# EasyEDA Pro project 轮腿PCB.eprj, board PCB1
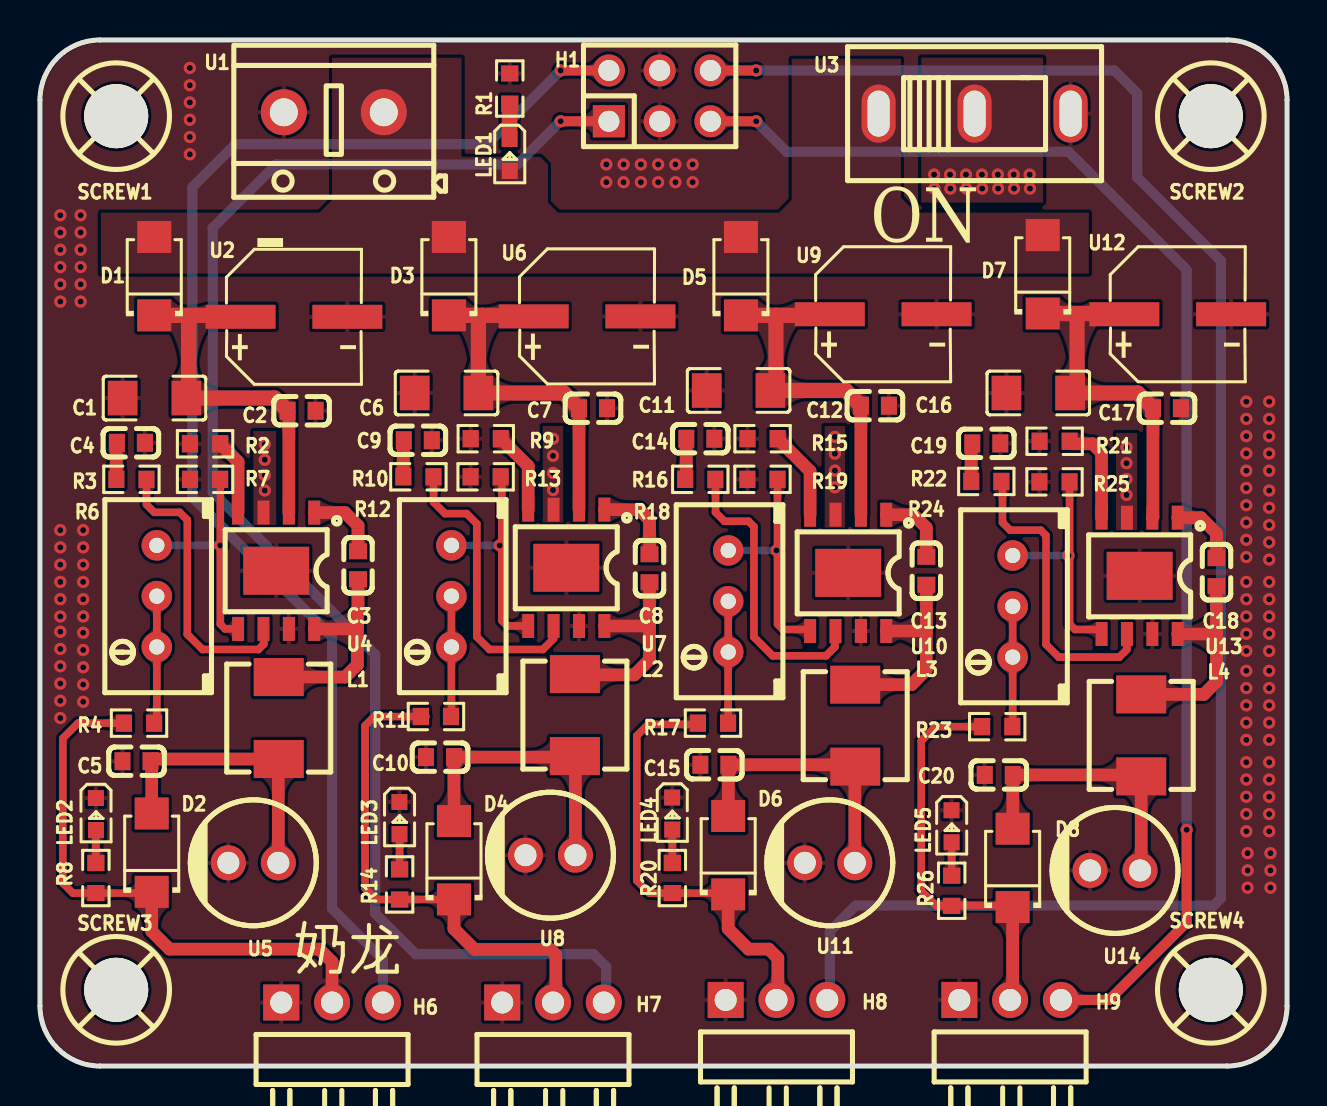
[diagram p6: board, top side]
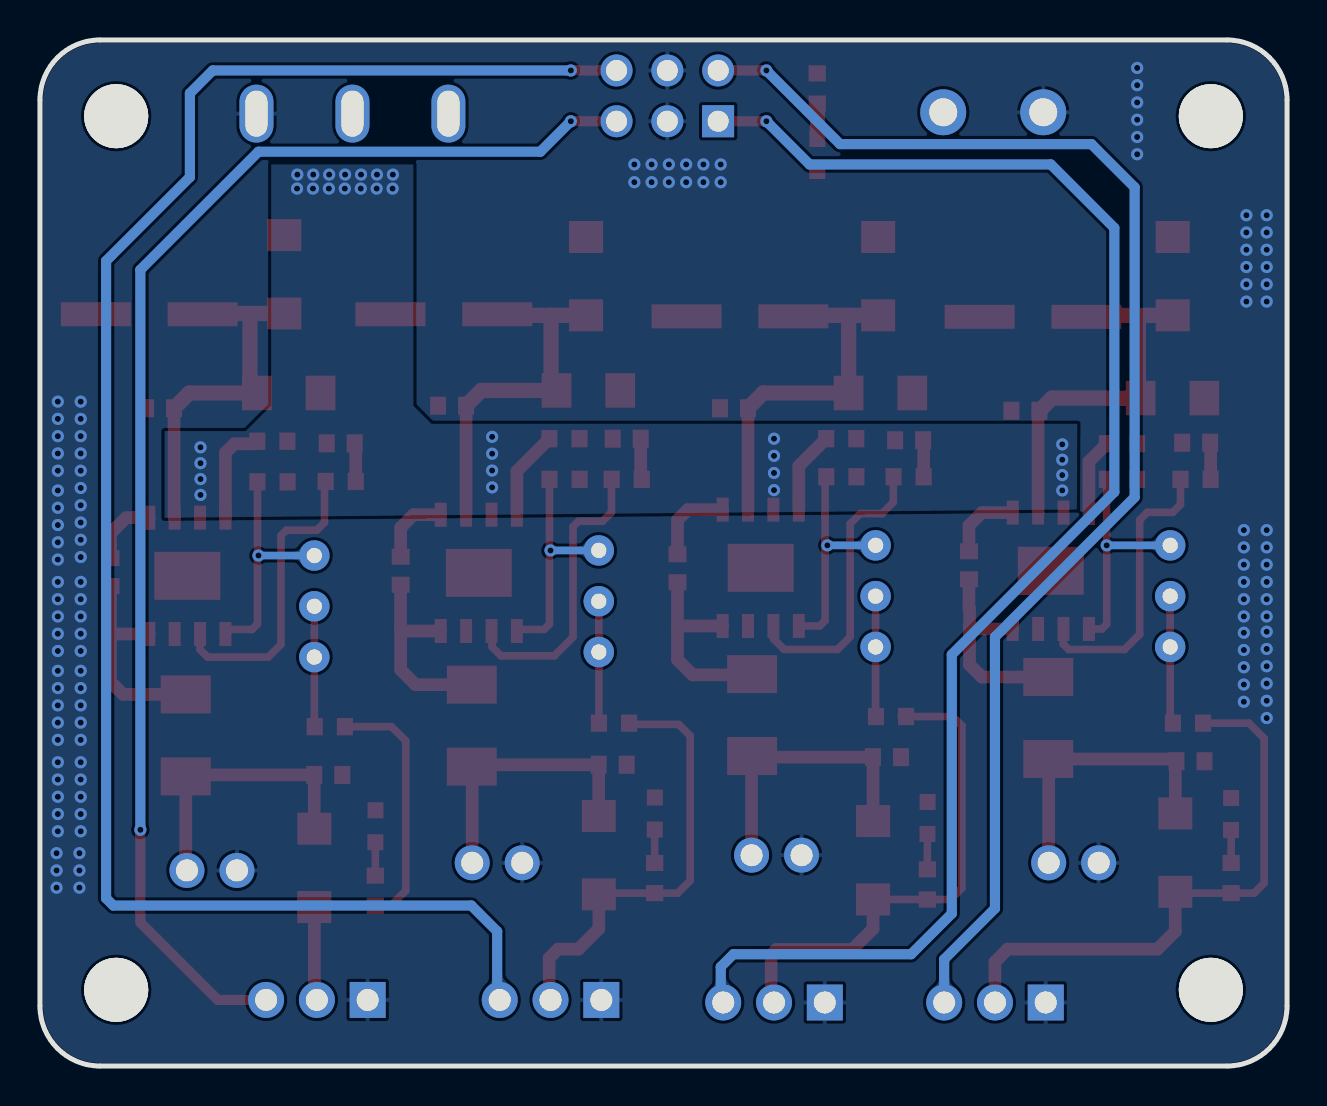
[diagram p7: board, bottom side, seen from below]

Outline 62.36 x 51.31 mm; copper layers: Top Layer, Bottom Layer. Coordinates in mm from the lower left corner of the outline.
Outline path: 0,48.31 0,3 arc(0.88,0.88) 3,0 59.36,0 arc(61.48,0.88) 62.36,3 62.36,48.31 arc(61.48,50.43) 59.36,51.31 3,51.31 arc(0.88,50.43) 0,48.31
Stack: Top Layer 0.035mm / Dielectric1 1.51mm FR4 er 4.5 / Bottom Layer 0.035mm

## Design rules (mm)
template: JLCPCB Capability(Two Layers Board)
spacing copperThickness1oz (default): track to track 0.102, other pairs 0.152 to 0.3
spacing copperThickness2oz: track to track 0.203, other pairs 0.152 to 0.3
track width copperThickness1oz (default): min 0.127, default 0.254, max 2.54
track width copperThickness2oz: min 0.203, default 0.254, max 2.54
differential pair differentialPair (default): width min 0.127, default 0.254, max 2.54; gap min 0.152, default 0.152
via viaSize (default): diameter min 0.5, default 0.61, max 10; hole min 0.3, default 0.305, max 6.3

## Placement (name value [footprint] x y rotation side)
C1  4.7uF  [C1206]  5.73 33.4 0 top
C2  100nF  [C0603]  13.08 32.77 0 top
C3  100nF  [C0603]  15.9 25.04 270 top
C4  4.7nF  [C0603]  4.54 31.17 0 top
C5  47uF  [C0603]  4.83 15.24 0 top
C6  4.7uF  [C1206]  20.33 33.66 0 top
C7  100nF  [C0603]  27.65 32.89 0 top
C8  100nF  [C0603]  30.48 24.89 270 top
C9  4.7nF  [C0603]  18.9 31.29 0 top
C10  47uF  [C0603]  20.01 15.45 0 top
C11  4.7uF  [C1206]  34.94 33.78 0 top
C12  100nF  [C0603]  41.75 33.02 0 top
C13  100nF  [C0603]  44.32 24.77 270 top
C14  4.7nF  [C0603]  33.02 31.37 0 top
C15  47uF  [C0603]  33.72 15.06 0 top
C16  4.7uF  [C1206]  49.92 33.66 0 top
C17  100nF  [C0603]  56.36 32.89 0 top
C18  100nF  [C0603]  58.83 24.7 270 top
C19  4.7nF  [C0603]  47.32 31.14 0 top
C20  47uF  [C0603]  47.95 14.56 0 top
D1  SS54F  [SMAF_L3.5-W2.6-LS4.7-RD-1]  5.72 39.5 90 top
D2  SS54F  [SMAF_L3.5-W2.6-LS4.7-RD-1]  5.59 10.67 90 top
D3  SS54F  [SMAF_L3.5-W2.6-LS4.7-RD-1]  20.45 39.5 90 top
D4  SS54F  [SMAF_L3.5-W2.6-LS4.7-RD-1]  20.7 10.29 90 top
D5  SS54F  [SMAF_L3.5-W2.6-LS4.7-RD-1]  35.05 39.5 90 top
D6  SS54F  [SMAF_L3.5-W2.6-LS4.7-RD-1]  34.41 10.54 90 top
D7  SS54F  [SMAF_L3.5-W2.6-LS4.7-RD-1]  50.14 39.59 90 top
D8  SS54F  [SMAF_L3.5-W2.6-LS4.7-RD-1]  48.64 9.91 90 top
H1  -  [HDR-TH_6P-P2.54-V-R2-C3-S2.54_A2541WV-2X3P]  30.99 48.52 0 top
H6  PZ254R-11-03P  [HDR-TH_3P-P2.54-H-M-W10.4]  14.6 3.18 0 top
H7  PZ254R-11-03P  [HDR-TH_3P-P2.54-H-M-W10.4]  25.65 3.18 0 top
H8  PZ254R-11-03P  [HDR-TH_3P-P2.54-H-M-W10.4]  36.83 3.3 0 top
H9  PZ254R-11-03P  [HDR-TH_3P-P2.54-H-M-W10.4]  48.51 3.3 0 top
L1  4.7uH  [IND-SMD_L5.4-W5.2_FXL0530]  11.94 17.4 270 top
L2  4.7uH  [IND-SMD_L5.4-W5.2_FXL0530]  26.75 17.55 270 top
L3  4.7uH  [IND-SMD_L5.4-W5.2_FXL0530]  40.77 17.02 270 top
L4  4.7uH  [IND-SMD_L5.4-W5.2_FXL0530]  55.07 16.53 270 top
LED1  -  [LED_0603]  23.49 45.51 270 top
LED2  -  [LED_0603]  2.8 12.55 270 top
LED3  -  [LED_0603]  17.98 12.35 270 top
LED4  -  [LED_0603]  31.62 12.58 270 top
LED5  -  [LED_0603]  45.59 11.94 270 top
R1  20K  [R0603]  23.49 48.88 90 top
R2  200K  [R0603]  8.25 31.12 0 top
R3  20K  [R0603]  4.57 29.34 180 top
R4  30K  [R0603]  4.95 17.15 180 top
R6  50kΩ  [RES-ADJ-TH_3296W]  5.84 23.5 180 top
R7  7.5K  [R0603]  8.25 29.34 0 top
R8  10K  [R0603]  2.79 9.4 270 top
R9  200K  [R0603]  22.29 31.37 0 top
R10  20K  [R0603]  18.92 29.47 180 top
R11  30K  [R0603]  19.8 17.48 180 top
R12  50kΩ  [RES-ADJ-TH_3296W]  20.57 23.5 180 top
R13  7.5K  [R0603]  22.29 29.47 0 top
R14  10K  [R0603]  17.98 9.08 270 top
R15  200K  [R0603]  36.13 31.37 0 top
R16  20K  [R0603]  33.02 29.34 180 top
R17  30K  [R0603]  33.66 17.15 180 top
R18  50kΩ  [RES-ADJ-TH_3296W]  34.42 23.24 180 top
R19  7.5K  [R0603]  36.13 29.34 0 top
R20  10K  [R0603]  31.62 9.4 270 top
R21  200K  [R0603]  50.74 31.24 0 top
R22  20K  [R0603]  47.32 29.23 180 top
R23  30K  [R0603]  47.87 16.97 180 top
R24  50kΩ  [RES-ADJ-TH_3296W]  48.64 22.99 180 top
R25  7.5K  [R0603]  50.73 29.21 0 top
R26  10K  [R0603]  45.59 8.77 270 top
SCREW1  -  [M3螺丝]  3.81 47.5 0 top
SCREW2  -  [M3螺丝]  58.55 47.5 0 top
SCREW3  -  [M3螺丝]  3.81 3.81 0 top
SCREW4  -  [M3螺丝]  58.55 3.81 0 top
U1  GS004-5.0-02P-12-00A(H)  [CONN-TH_GS004-5.0-02P-12-00A-H]  14.69 47.7 180 top
U2  100uF  [CAP-SMD_BD6.3-L6.6-W6.6-LS7.2-FD-1]  12.7 37.47 0 top
U3  SS12D10G5  [SW-TH_SHOU-HAN_SS12D10G4]  46.74 47.63 0 top
U4  SCT2450CQSTER  [ESOP-8_L4.9-W3.9-P1.27-LS6.0-BL-EP]  11.81 24.77 180 top
U5  220uF/15V  [CAP-TH_BD6.3-P2.50-D0.6-FD-1]  10.67 10.16 180 top
U6  100uF  [CAP-SMD_BD6.3-L6.6-W6.6-LS7.2-FD-1]  27.36 37.49 0 top
U7  SCT2450CQSTER  [ESOP-8_L4.9-W3.9-P1.27-LS6.0-BL-EP]  26.32 24.92 180 top
U8  220uF/15V  [CAP-TH_BD6.3-P2.50-D0.6-FD-1]  25.53 10.54 180 top
U9  100uF  [CAP-SMD_BD6.3-L6.6-W6.6-LS7.2-FD-1]  42.16 37.59 0 top
U10  SCT2450CQSTER  [ESOP-8_L4.9-W3.9-P1.27-LS6.0-BL-EP]  40.42 24.66 180 top
U11  220uF/15V  [CAP-TH_BD6.3-P2.50-D0.6-FD-1]  39.5 10.16 180 top
U12  100uF  [CAP-SMD_BD6.3-L6.6-W6.6-LS7.2-FD-1]  56.9 37.59 0 top
U13  SCT2450CQSTER  [ESOP-8_L4.9-W3.9-P1.27-LS6.0-BL-EP]  54.99 24.51 180 top
U14  220uF/15V  [CAP-TH_BD6.3-P2.50-D0.6-FD-1]  53.76 9.78 180 top

## Footprints (pads in the part's own frame, mm; a bottom-side part is the same pattern mirrored in y, then rotated)
C0603
  rect 0.8x0.9 smd: 1(-0.7,0) 2(0.7,0)
C1206
  rect 1.485x1.728 smd: 1(-1.593,0) 2(1.593,0)
CAP-SMD_BD6.3-L6.6-W6.6-LS7.2-FD-1
  rect 3.5x1.2 smd: 1(-2.67,0) 2(2.67,0)
CAP-TH_BD6.3-P2.50-D0.6-FD-1
  round 1.75 hole 1.1: 1(-1.25,0) 2(1.25,0)
CONN-TH_GS004-5.0-02P-12-00A-H
  round 2.3 hole 1.4: 1(-2.5,0) 2(2.5,0)
ESOP-8_L4.9-W3.9-P1.27-LS6.0-BL-EP
  rect 0.6x1.2 smd: 1(-1.905,-2.909) 2(-0.635,-2.909) 3(0.635,-2.909) 4(1.905,-2.909) 5(1.905,2.909) 6(0.635,2.909) 7(-0.635,2.909) 8(-1.905,2.909)
  rect 3.3x2.4 smd: 9(0,0)
HDR-TH_3P-P2.54-H-M-W10.4
  rect 1.8x1.8 hole 1.1: 1(-2.54,0)
  round 1.8 hole 1.1: 2(0,0) 3(2.54,0)
HDR-TH_6P-P2.54-V-R2-C3-S2.54_A2541WV-2X3P
  rect 1.6x1.6 hole 1.05: 1(-2.54,-1.27)
  round 1.6 hole 1.05: 2(-2.54,1.27) 3(0,-1.27) 4(0,1.27) 5(2.54,-1.27) 6(2.54,1.27)
IND-SMD_L5.4-W5.2_FXL0530
  rect 1.9x2.5 smd: 1(-2.05,0) 2(2.05,0)
LED_0603
  rect 0.8x0.8 smd: 1(-0.851,-0.01) 2(0.75,-0.005)
M3螺丝
  round 3.2 hole 3.2: 1(0,0)
R0603
  rect 0.806x0.864 smd: 1(-0.753,0) 2(0.753,0)
RES-ADJ-TH_3296W
  round 1.524 hole 0.762: 1(0,2.54) 2(0,0) 3(0,-2.54)
SMAF_L3.5-W2.6-LS4.7-RD-1
  rect 1.6x1.7 smd: 1(-1.96,0) 2(1.96,0)
SW-TH_SHOU-HAN_SS12D10G4
  oval 1.7x2.9 hole 1.1x2.3: 1(-4.8,0) 2(0,0) 3(4.8,0)

## Nets
As in the schematic.

Pads without a net: SCREW1 1; SCREW2 1; SCREW3 1; SCREW4 1

## Via types
v1: diameter 0.61, hole 0.305, Top Layer to Bottom Layer, 148 vias

## Routing (per net, layer and track width the routed paths; a pad name or vN(x,y) marks a point on that pad's centre or on a via; arc(x,y) is an arc through that point)
GND:
  vias: v1(1.02,42.55) v1(1.02,41.68) v1(1.02,40.82) v1(1.02,39.96) v1(1.02,39.09) v1(1.02,38.23) v1(1.02,26.8) v1(1.02,25.94) v1(1.02,25.07) v1(1.02,24.21) v1(1.02,23.34) v1(1.02,22.48) v1(1.02,21.72) v1(1.02,20.86) v1(1.02,19.99) v1(1.02,19.13) v1(1.02,18.26) v1(1.02,17.4) v1(2.03,42.55) v1(2.03,41.68) v1(2.03,40.82) v1(2.03,39.96) v1(2.03,39.09) v1(2.03,38.23) v1(2.16,26.8) v1(2.16,25.94) v1(2.16,25.07) v1(2.16,24.21) v1(2.16,23.34) v1(2.16,22.48) v1(2.16,21.67) v1(2.16,20.8) v1(2.16,19.94) v1(2.16,19.08) v1(2.16,18.21) v1(7.49,49.91) v1(7.49,49.05) v1(7.49,48.19) v1(7.49,47.32) v1(7.49,46.46) v1(7.49,45.59) v1(28.32,45.09) v1(28.32,44.2) v1(29.18,45.09) v1(29.18,44.2) v1(30.05,45.09) v1(30.05,44.2) v1(30.91,45.09) v1(30.91,44.2) v1(31.78,45.09) v1(31.78,44.2) v1(32.64,45.09) v1(32.64,44.2) v1(60.32,33.23) v1(60.32,32.36) v1(60.32,31.5) v1(60.32,30.63) v1(60.32,29.77) v1(60.32,28.91) v1(60.32,28.04) v1(60.32,27.18) v1(60.32,26.32) v1(60.32,25.45) v1(60.32,24.21) v1(60.32,23.34) v1(60.32,22.48) v1(60.32,21.62) v1(60.32,20.75) v1(60.32,19.76) v1(60.32,18.9) v1(60.32,18.04) v1(60.32,17.17) v1(60.32,16.31) v1(60.32,15.19) v1(60.32,14.33) v1(60.32,13.46) v1(60.32,12.6) v1(60.32,11.74) v1(60.39,10.64) v1(60.39,9.78) v1(60.39,8.92) v1(61.47,33.23) v1(61.47,32.36) v1(61.47,31.5) v1(61.47,30.63) v1(61.47,29.77) v1(61.47,28.78) v1(61.47,27.92) v1(61.47,27.05) v1(61.47,26.19) v1(61.47,25.33) v1(61.47,24.21) v1(61.47,23.34) v1(61.47,22.48) v1(61.47,21.62) v1(61.47,20.75) v1(61.47,19.76) v1(61.47,18.9) v1(61.47,18.04) v1(61.47,17.17) v1(61.47,16.31) v1(61.47,15.19) v1(61.47,14.33) v1(61.47,13.46) v1(61.47,12.6) v1(61.47,11.74) v1(61.53,10.64) v1(61.53,9.78) v1(61.53,8.92)
VCCSREER1: length 28.6
  Top Layer w0.381: D2.1 5.52,8.65 R8.2 1.64,8.65 1.14,9.15 1.14,16.39 1.91,17.15 R4.2
  Top Layer w0.635: D2.1 5.59,8.71 5.59,6.73 6.48,5.84 13.97,5.84 14.6,5.21 14.6,3.56
VCCSREER2: length 25.1
  Top Layer w0.381: D4.1 17.99,8.33 R14.2 16.82,8.33 16.26,8.89 16.26,17.02 16.71,17.48 19.3,17.48
  Top Layer w0.635: 25.78,3.6 25.8,3.62 25.8,5.56 25.53,5.83 21.73,5.83 20.7,6.86 D4.1
VCCSREER3: length 21.9
  Top Layer w0.381: 34.41,8.58 34.35,8.65 R20.2 30.47,8.65 29.84,9.27 29.84,16.51 30.42,17.08 32.84,17.08 R17.2
  Top Layer w0.635: 36.95,3.77 36.9,3.82 36.9,5.39 36.45,5.84 35.43,5.84 34.41,6.86 34.41,8.58
VCCSREER4: length 19.9
  Top Layer w0.381: 48.7,8.01 48.77,7.95 ; R23.2 44.78,16.97 44.07,16.26 44.07,8.77 44.82,8.01 R26.2 48.64,8.01
  Top Layer w0.635: D8.1 48.64,3.82 48.63,3.81
EN:
  vias: v1(11.24,31.09) v1(11.24,30.32) v1(11.24,29.55) v1(11.24,28.78) v1(25.65,31.37) v1(25.65,30.51) v1(25.65,29.66) v1(25.65,28.8) v1(39.75,31.46) v1(39.75,30.62) v1(39.75,29.78) v1(39.75,28.94) v1(44.71,44.58) v1(44.73,43.88) v1(45.51,44.58) v1(45.52,43.88) v1(46.31,44.58) v1(46.32,43.88) v1(47.1,44.58) v1(47.12,43.88) v1(47.9,44.58) v1(47.91,43.88) v1(48.69,44.58) v1(48.71,43.88) v1(49.49,44.58) v1(49.51,43.88) v1(54.33,30.94) v1(54.33,30.15) v1(54.33,29.35) v1(54.33,28.56)
SREER1: length 67.6
  Top Layer w0.508: H1.2 v1(26.03,49.79)
  Bottom Layer w0.508: v1(26.03,49.79) 22.35,46.1 9.78,46.1 7.62,43.94 7.62,28.44 14.6,21.45 14.6,7.88 17.15,5.34 17.15,3.56
SREER2: length 73.7
  Top Layer w0.508: H1.1 v1(26.03,47.25)
  Bottom Layer w0.508: v1(26.03,47.25) 23.88,45.09 11.81,45.09 8.64,41.91 8.64,28.7 16.76,20.58 16.76,7.62 18.8,5.59 27.69,5.59 28.32,4.96 28.32,3.6
SREER3: length 87
  Top Layer w0.508: H1.6 v1(35.81,49.79)
  Bottom Layer w0.508: 39.49,3.77 39.5,3.78 39.5,6.73 40.79,8.03 58.7,8.03 59.06,8.38 59.06,40.26 54.86,44.45 54.86,48.64 53.72,49.79 v1(35.81,49.79)
SREER4: length 67.5
  Top Layer w0.508: v1(57.34,11.81) 57.34,7.18 53.47,3.3 51.68,3.3 51.17,3.81 ; H1.5 v1(35.81,47.25)
  Bottom Layer w0.508: v1(35.81,47.25) 37.34,45.72 51.44,45.72 57.34,39.82 v1(57.34,11.81)
$1N1137: length 19
  Top Layer w0.635: U4.2 12.45,32.7 C2.1
  Top Layer w0.762: D1.1 7.43,37.54 ; 7.43,37.54 9.96,37.54 U2.1 ; 7.43,37.54 7.43,33.52 C1.2 11.75,33.4 C2.1
$1N1283: length 1.8
  Top Layer w0.762: R1.1 23.48,48.12 LED1.1
$1N2088: length 3.8
  Top Layer w0.635: R2.2 9.91,30.22 U4.4
$1N2223: length 3.7
  Top Layer w0.635: U4.1 15.25,27.68 15.9,27.02 C3.1
$1N2417: length 1.8
  Top Layer w0.635: C4.1 3.82,31.14 R3.2
$1N2458: length 10.7
  Top Layer w0.635: U4.8 15.76,21.86 15.88,21.97 ; C3.2 15.9,22.88 15.88,22.85 15.88,21.97 ; L1.1 15.26,19.45 15.88,20.07 15.88,21.97
$1N2471: length 14.4
  Top Layer w0.381: R3.1 5.33,28.08 5.72,27.69 6.98,27.69 7.37,27.31 7.37,21.59 8.13,20.83 10.92,20.83 11.19,21.1 11.19,21.84 U4.6
$1N2543: length 14.3
  Top Layer w0.635: D2.2 5.59,15.24 ; U5.1 11.92,15.33 L1.2 5.64,15.35 C5.2
$1N3084: length 6.5
  Top Layer w0.381: R6.2 5.84,17.15 R4.1
$1N3157: length 1.6
  Top Layer w0.381: R8.1 2.79,11.8 LED2.2
$1N3217: length 11.4
  Top Layer w0.381: R7.2 9.02,29.33 v1(9.02,26.04) 9.02,22.1 9.26,21.86 U4.5
  Bottom Layer w0.381: R6.3 v1(9.02,26.04)
$1N3929: length 18.6
  Top Layer w0.635: U7.2 C7.1
  Top Layer w0.762: 22.12,37.54 24.63,37.54 U6.1 ; 22.12,37.54 D3.1 ; 22.12,37.54 21.92,37.34 C6.2 26.19,33.66 C7.1
$1N3944: length 4.1
  Top Layer w0.635: 24.41,27.82 24.41,30 23.04,31.37
$1N3951: length 4.2
  Top Layer w0.635: 28.22,27.82 29.96,27.82 30.48,27.31 C8.1
$1N3955: length 1.8
  Top Layer w0.635: C9.1 18.17,31.27 R10.2
$1N3960: length 10.7
  Top Layer w0.635: 30.48,22.01 30.48,20.32 29.72,19.56 26.28,19.56 26.24,19.6 ; 30.48,22.01 C8.2 ; 30.48,22.01 U7.8
$1N3965: length 14.5
  Top Layer w0.381: U7.6 25.68,21.37 25.15,20.83 22.48,20.83 21.84,21.47 21.84,27.12 21.34,27.62 20.26,27.62 19.69,28.2 19.69,29.46 R10.1
$1N3967: length 14.1
  Top Layer w0.635: C10.2 20.7,15.45 D4.2 ; 20.83,15.45 26.7,15.45 L2.2 26.78,15.47 U8.1
$1N3983: length 6.3
  Top Layer w0.381: 20.19,20.96 20.57,21.34 20.57,23.12 20.19,23.5 ; 20.57,20.96 20.57,17.5 R11.1
$1N3988: length 1.8
  Top Layer w0.381: 17.98,11.6 17.98,11.6 R14.1
$1N3993: length 11.4
  Top Layer w0.381: 23.04,29.47 23.1,29.41 23.1,22.28 23.37,22.01 U7.5
  Bottom Layer w0.381: 20.19,26.04 v1(22.99,26.04)
$1N4688: length 18.6
  Top Layer w0.635: C12.1 41.05,27.57
  Top Layer w0.762: U9.1 39.44,37.54 36.8,37.54 ; 36.8,37.54 36.8,34.06 C11.2 40.29,33.78 C12.1 ; 36.8,37.54 D5.1
$1N4703: length 4.5
  Top Layer w0.635: R15.2 38.51,29.75 U10.4
$1N4710: length 3.7
  Top Layer w0.635: U10.1 43.68,27.57 44.32,26.93 C13.1
$1N4714: length 2.1
  Top Layer w0.635: 32.24,29.39 32.31,29.39 32.32,29.4 C14.1
$1N4719: length 10.1
  Top Layer w0.635: 44.32,21.75 44.33,21.76 44.33,24.06 C13.2 ; 44.32,21.75 44.32,19.81 43.58,19.07 L3.1 ; 44.32,21.75 U10.8
$1N4724: length 14.8
  Top Layer w0.381: U10.6 39.75,21.72 39.75,20.96 39.31,20.51 36.64,20.51 35.7,21.45 35.7,26.97 35.43,27.24 34.23,27.24 33.78,27.69 33.78,29.33 R16.1
$1N4726: length 13.8
  Top Layer w0.635: D6.2 34.42,12.51 C15.2 40.67,15.06 L3.2 40.75,14.95 U11.1
$1N4742: length 6
  Top Layer w0.381: R18.2 R18.1 34.41,20.69 34.41,17.27 34.44,17.25
$1N4747: length 1.7
  Top Layer w0.381: LED4.2 31.62,11.82 R20.1
$1N4752: length 11.4
  Top Layer w0.381: U10.5 38.43,21.83 37.15,21.83 36.88,22.1 R19.2
  Bottom Layer w0.381: 34.42,25.78 v1(36.83,25.78)
$1N5447: length 18.2
  Top Layer w0.635: U13.2 55.66,27.45 C17.1
  Top Layer w0.762: C17.1 54.89,33.66 C16.2 51.86,34 51.86,37.63 ; D7.1 51.86,37.63 ; 51.86,37.63 54.19,37.63 U12.1
$1N5462: length 5.1
  Top Layer w0.635: U13.4 53.09,30.67 52.64,31.12 51.62,31.12 R21.2
$1N5469: length 3.5
  Top Layer w0.635: C18.1 58.83,26.64 58.05,27.42 U13.1
$1N5473: length 1.9
  Top Layer w0.635: C19.1 46.57,31.08 46.57,29.23
$1N5478: length 10.8
  Top Layer w0.635: 58.83,21.63 C18.2 ; 58.83,21.63 58.81,21.6 U13.8 ; 58.83,21.63 58.83,19.22 58.2,18.58 L4.1
$1N5483: length 15.2
  Top Layer w0.381: U13.6 54.36,20.83 53.97,20.45 50.94,20.45 50.31,21.08 50.31,26.53 50.04,26.8 48.51,26.8 48.13,27.18 48.13,29.18 R22.1
$1N5485: length 13.9
  Top Layer w0.635: U14.1 55.07,9.84 L4.2 55,14.56 C20.2 48.65,11.99 48.53,11.87 48.51,11.87
$1N5501: length 6
  Top Layer w0.381: R23.1 48.64,16.97 R24.1 R24.2
$1N5506: length 1.7
  Top Layer w0.381: R26.1 45.59,11.19 LED5.2
$1N5511: length 11.7
  Top Layer w0.381: U13.5 52.86,21.83 51.76,21.83 51.49,22.1 51.49,29.21
  Bottom Layer w0.381: R24.3 v1(51.44,25.53)

## Copper pours and planes (outline as drawn; the poured copper is in the pictures)
GND on Top Layer: -19.69,64.9 78.87,64.9 78.87,-12.32 -19.69,-12.32
GND on Bottom Layer: -4.44,51.44 66.93,51.44 66.93,-4.57 -4.44,-4.57
VIN on Top Layer: 3.05,50.42 52.45,50.42 52.45,39.63 3.05,39.63
EN on Top Layer: 10.67,31.75 11.81,31.75 11.81,27.05 10.67,27.05
EN on Top Layer: 39.24,32.01 40.26,32.01 40.26,26.93 39.24,26.93
EN on Top Layer: 25.15,32.01 26.16,32.01 26.16,27.18 25.15,27.18
EN on Top Layer: 44.07,50.42 50.16,50.42 50.16,43.18 44.07,43.18
EN on Top Layer: 53.81,31.65 54.86,31.65 54.86,26.8 53.81,26.8
EN on Bottom Layer: 10.49,45.09 56.13,45.09 56.13,27.42 10.49,27.42

Small or netless copper shapes (teardrops, artwork), in the pictures only: 165 on Top Layer, 17 on Bottom Layer

## Text on the board
Top Silkscreen Layer: 奶龙 | ON | -
